# Altium schematic sheet voltage_adjustable_supply.SchDoc
size A; SheetNumber: 3; SheetTotal: 9
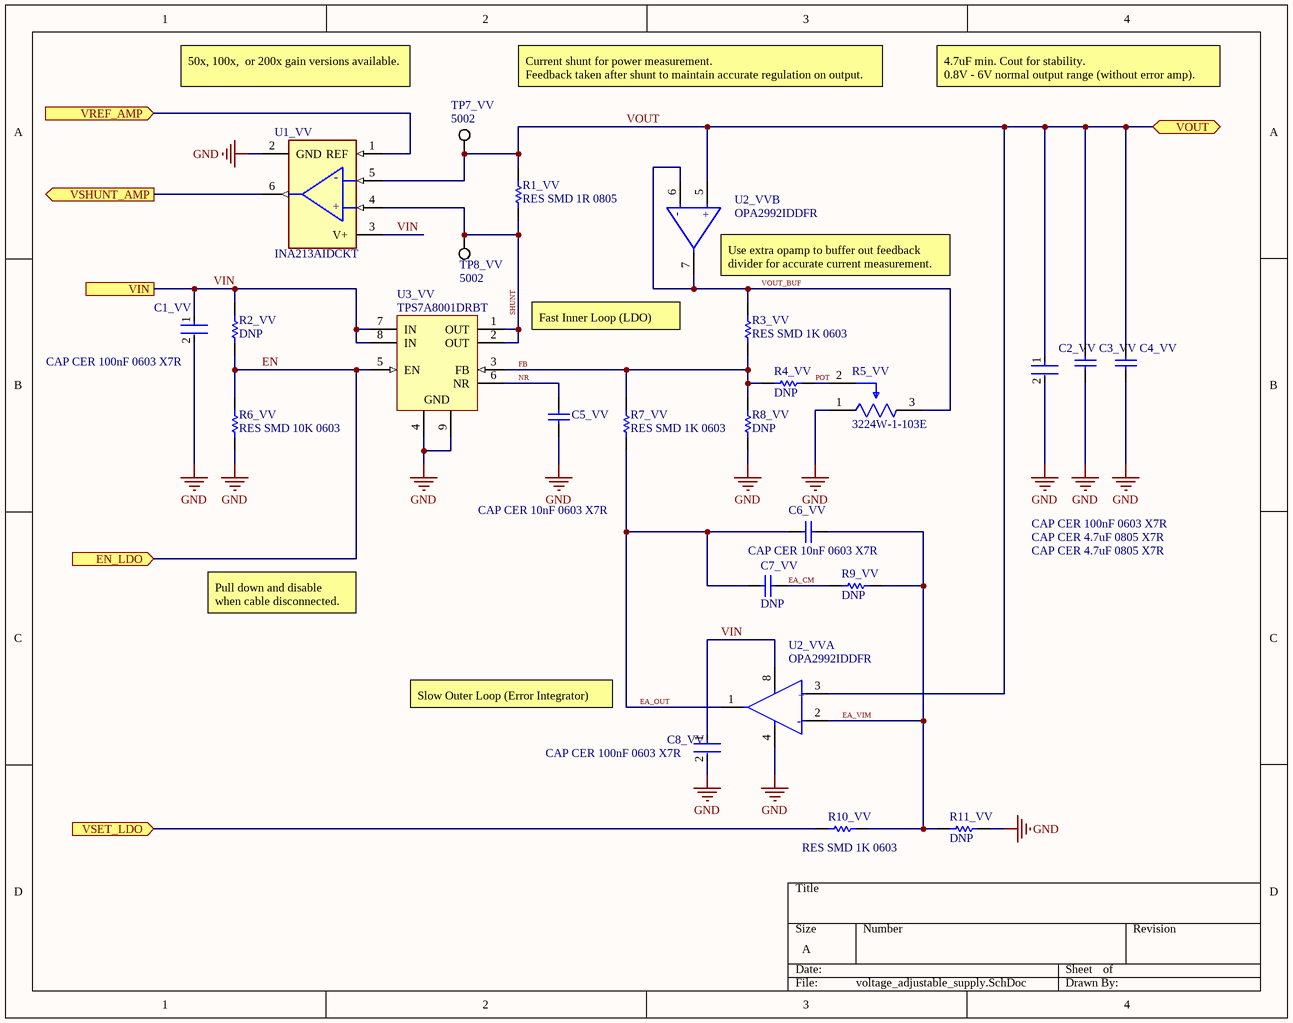
[diagram p0: voltage_adjustable_supply.SchDoc]

## Parts
C1_VV  CAP CER 100nF 0603 X7R  [FP-CC0603-DA-MFG]
C2_VV  CAP CER 100nF 0603 X7R  [FP-CC0603-DA-MFG]
C3_VV  CAP CER 4.7uF 0805 X7R  [CAPC2013X140X50NL20T25]
C4_VV  CAP CER 4.7uF 0805 X7R  [CAPC2013X140X50NL20T25]
C5_VV  CAP CER 10nF 0603 X7R  [CAPC1608X90X40ML10T20]
C6_VV  CAP CER 10nF 0603 X7R  [CAPC1608X90X40ML10T20]
C7_VV  DNP  [CAPC1608X90X40ML10T20]
C8_VV  CAP CER 100nF 0603 X7R  [FP-CC0603-DA-MFG]
R1_VV  RES SMD 1R 0805  [RESC2013X50X30NL20T20]
R2_VV  DNP  [RESC1609X50X30LL10T20]
R3_VV  RES SMD 1K 0603  [RESC1609X50X30LL10T20]
R4_VV  DNP  [RESC1609X50X30LL10T20]
R5_VV  3224W-1-103E  [FP-3224W-MFG]
R6_VV  RES SMD 10K 0603  [RESC1609X50X30LL10T20]
R7_VV  RES SMD 1K 0603  [RESC1609X50X30LL10T20]
R8_VV  DNP  [RESC1609X50X30LL10T20]
R9_VV  DNP  [RESC1609X50X30LL10T20]
R10_VV  RES SMD 1K 0603  [RESC1609X50X30LL10T20]
R11_VV  DNP  [RESC1609X50X30LL10T20]
TP7_VV  5002  [KSTN-5002]
TP8_VV  5002  [KSTN-5002]
U1_VV  INA213AIDCKT  [FP-DCK0006A-MFG]
U2_VV  OPA2992IDDFR  [FP-DDF0008A-MFG]  (parts A,B of 2)
U3_VV  TPS7A8001DRBT  [DRB0008A_V]

## Ports
EN_LDO (in), VIN, VOUT (bidir), VREF_AMP (in), VSET_LDO (in), VSHUNT_AMP (out)

## Nets
GND: C1_VV.2 C2_VV.2 C3_VV.2 C4_VV.2 C5_VV.2 C8_VV.2 R5_VV.1(CCW) R6_VV.1 R8_VV.1 R11_VV.1 U1_VV.2(GND) U2_VV.4(V-) U3_VV.4(GND) U3_VV.9(GND)
EA_CM: C7_VV.2 R9_VV.2
EA_OUT: C6_VV.1 C7_VV.1 R7_VV.1 U2_VV.1(OUT1)
EA_VIM: C6_VV.2 R9_VV.1 R10_VV.1 R11_VV.2 U2_VV.2(IN1-)
EN: R2_VV.1 R6_VV.2 U3_VV.5(EN) ; port EN_LDO
FB: R3_VV.1 R4_VV.2 R7_VV.2 R8_VV.2 U3_VV.3(FB)
NR: C5_VV.1 U3_VV.6(NR)
POT: R4_VV.1 R5_VV.2(WIPER)
SHUNT: R1_VV.1 TP8_VV.1 U1_VV.4(IN+) U3_VV.1(OUT) U3_VV.2(OUT)
VIN: C1_VV.1 C8_VV.1 R2_VV.2 U1_VV.3(V+) U2_VV.8(V+) U3_VV.7(IN) U3_VV.8(IN) ; port VIN
VOUT: C2_VV.1 C3_VV.1 C4_VV.1 R1_VV.2 TP7_VV.1 U1_VV.5(IN-) U2_VV.3(IN1+) U2_VV.5(IN2+) ; port VOUT
VOUT_BUF: R3_VV.2 R5_VV.3(CW) U2_VV.6(IN2-) U2_VV.7(OUT2)
VREF_AMP: U1_VV.1(REF) ; port VREF_AMP
VSET_LDO: R10_VV.2 ; port VSET_LDO
VSHUNT_AMP: U1_VV.6(OUT) ; port VSHUNT_AMP

## Notes on the sheet
- 50x, 100x,  or 200x gain versions available.
- Current shunt for power measurement.
  Feedback taken after shunt to maintain accurate regulation on output.
- 4.7uF min. Cout for stability.
  0.8V - 6V normal output range (without error amp).
- (near U2_VV) Use extra opamp to buffer out feedback divider for accurate current measurement.
- Fast Inner Loop (LDO)
- Pull down and disable when cable disconnected.
- Slow Outer Loop (Error Integrator)
- (in symbol CMP-04895-000035-1) -; +
- (in symbol CMP-04895-000462-1, part A) +; -
- (in symbol CMP-04895-000462-1, part B) +; -

## Library data of the parts
C1_VV C2_VV C8_VV = CMP-03422-000030-1: CAP CER 0.1UF 16V X7R 0603; Manufacturer Part Number: CC0603KRX7R7BB104; Manufacturer: YAGEO; Tolerance: 0.1; Temperature Coefficient: 15%; Material: Ceramic; Voltage Rating: 16 V; Package: CC0603-DA; ComponentLink2Description: Datasheet; Octopart: https://octopart.com/cc0603krx7r7bb104-yageo-192941; Temperature Range High: +125°C; Digikey Description: CAP CER 0.1UF 16V X7R 0603; Value: 100 nF; Voltage: 16 V; Device Class L2: Capacitors; Height: 0.9mm; Temperature: -55°C to +125°C; Device Class L1: Passive Components; Device Class L3: Ceramic Capacitors; ComponentLink2URL: http://www.yageo.com/documents/recent/UPY-GPHC_X7R_6.3V-to-50V_18.pdf; Footprint Url: http://www.yageo.com/exep/pages/download/literatures/UPY-C_GEN_24.pdf; RoHS: TRUE; Temperature Range Low: -55°C; Temperature Characteristic: X7R; Lead Free: Yes; Capacitance: 100 nF; Category: Cap; Mouser Description: Multilayer Ceramic Capacitor, CC Series, 0.1 - F, - 10%, X7R, 16 V, 0603 [1608 Metric]; Automotive: No
C3_VV C4_VV = CMP-2007-04677-1: Part Number: 0805ZC475KAT2A; Manufacturer: AVX Interconnect / Elco
C5_VV C6_VV = CMP-2100-03600-1: Chip Capacitor, 10 nF, +/- 10%, 50 V, -55 to 125 degC, 0603 (1608 Metric), RoHS, Tape and Reel; Manufacturer: Yageo; Insulation Resistance: 100GR; Voltage Rating (DC): 50V; Material: Ceramic; Lead Free: LeadFree; Case/Package: 0603; Datasheet Version: Rev. 15, 10/2016; Composition: Ceramic; Radiation Hardening: No; Thickness: 0.035inch; RoHSCompliant: True; Dielectric: X7R; Termination: SMD/SMT; Capacitance: 10nF; Manufacturer URL: http://www.yageo.com/; Tolerance: 10%; REACH SVHC: NoSVHC; Voltage: 50V; Max Operating Temperature: 125degC; Case Code (Metric): 1608; Package Quantity: 1; Case Code (Imperial): 0603; Packaging: TapeandReel; Package Reference: 0603; Width: 0.031inch; Datasheet URL: http://www.yageo.com/documents/recent/UPY-GPHC_X7R_6.3V-to-50V_15.pdf; Length: 1.6mm; Min Operating Temperature: -55degC; Number of Pins: 2; Depth: 0.8mm; Mount: SurfaceMount; Height: 0.8mm; Voltage Rating: 50V; Package Description: 2-Pin Surface Mount Device, Body 1.6 x 0.8 mm
C7_VV = CMP-2100-03600-1: Chip Capacitor, 10 nF, +/- 10%, 50 V, -55 to 125 degC, 0603 (1608 Metric), RoHS, Tape and Reel; Manufacturer: Yageo; Insulation Resistance: 100GR; Dielectric: X7R; Voltage Rating (DC): 50V; Capacitance: 10nF; Material: Ceramic; Lead Free: LeadFree; Case/Package: 0603; Datasheet Version: Rev. 15, 10/2016; Composition: Ceramic; Radiation Hardening: No; Thickness: 0.035inch; RoHSCompliant: True; Termination: SMD/SMT; Manufacturer URL: http://www.yageo.com/; Tolerance: 10%; REACH SVHC: NoSVHC; Voltage: 50V; Max Operating Temperature: 125degC; Case Code (Metric): 1608; Package Quantity: 1; Case Code (Imperial): 0603; Packaging: TapeandReel; Package Reference: 0603; Width: 0.031inch; Datasheet URL: http://www.yageo.com/documents/recent/UPY-GPHC_X7R_6.3V-to-50V_15.pdf; Length: 1.6mm; Min Operating Temperature: -55degC; Number of Pins: 2; Depth: 0.8mm; Mount: SurfaceMount; Height: 0.8mm; Voltage Rating: 50V; Package Description: 2-Pin Surface Mount Device, Body 1.6 x 0.8 mm
R1_VV = CMP-2001-04897-1: Manufacturer: Vishay Dale; Part Number: CRCW08050000Z0EB
R2_VV R4_VV R8_VV R9_VV R11_VV = CMP-2000-03820-1: Part Number: CRCW0603100KFKEA; Manufacturer: Vishay Dale
R3_VV R6_VV R7_VV R10_VV = CMP-2000-03820-1: DNP; Part Number: CRCW0603100KFKEA; Manufacturer: Vishay Dale
R5_VV = CMP-07234-000002-1: TRIMMER 10K OHM 0.25W J LEAD TOP; Manufacturer: Bourns; Tolerance: 10%; Resistance: 10kΩ; Temperature Coefficient: 100ppm/°C; Value: 10kΩ; Standoff Height: 0.2mm; Voltage Rating: 300V; Power Rating: 250mW; Device Class L3: Variable Resistors and Potentiometers; Composition: Cermet; Temperature Range Low: -65°C; Package: 3224W; ComponentLink2Description: Datasheet; Digikey Description: TRIMMER 10K OHM 0.25W J LEAD TOP; Category: Res; Mouser Description: Trimmer Resistors - SMD 4mm 10Kohms 10% Square Cermet Sealed; Temperature: -65°C to +150°C; Device Class L2: Resistors; Device Class L1: Passive Components; RoHS: TRUE; Temperature Range High: +150°C; Manufacturer Part Number: 3224W-1-103E; ComponentLink2URL: https://upverter.com/datasheet/a166fca85da25564670351d2dc712345c058bc40.pdf; Series: 3224; Height: 5.55mm; Lead Free: Yes; Octopart: https://octopart.com/3224w-1-103e-bourns-14818; Automotive: No
TP7_VV TP8_VV = CMP-2000-05182-1: Test Point, White, 1-Pin THD, RoHS, Bulk; Manufacturer: KeystoneElectronics; Outside Diameter: 2.54mm; Plating: Silver; Mounting Hole Size: 1mm; Product: TestPoints; Packaging: Bulk; Manufacturer URL: http://www.keyelco.com/; Length: 7.62mm; Datasheet Version: Rev. G, 12/2008; Type: Miniature; Product Category: CircuitBoardHardware-PCB; Material: Nylon; RoHS: True; Contact Material: PhosphorBronze; Datasheet URL: https://ciiva.com/datasheet-click-2917627?src=ciiva&sig=bd195616; Color: White; Brand: KeystoneElectronics
U1_VV = CMP-04895-000035-1: IC CURR SENSE 1 CIRCUIT SC70-6; Manufacturer: Texas Instruments; Standoff Height: 0mm; Input Bias Current: 35uA; Max Junction Temp: +150°C; Number Of Channels: 1; Max Supply Voltage: 26V; Min Supply Voltage: 2.7V; Nominal Supply Current: 100uA; Gain Bandwidth: 80kHz; Height: 0.8mm; Device Class L3: Amplifiers - Op Amps; Category: IC; Device Class L1: Integrated Circuits (ICs); Digikey Description: IC CURR SENSE 1 CIRCUIT SC70-6; Temperature Range High: +125°C; Device Class L2: Linear ICs; Package: DCK0006A; Mouser Description: SP Amp Current Shunt Monitor Single 26V 6-Pin SC-70 T/R; RoHS: TRUE; Automotive: No; Octopart: https://octopart.com/ina213aidckt-texas+instruments-7767892; Lead Free: Yes; Manufacturer Part Number: INA213AIDCKT; Temperature Range Low: -40°C; Ambient Temperature Range High: +125°C; ComponentLink2URL: http://www.ti.com/lit/ds/symlink/ina211.pdf; Ambient Temperature Range Low: -40°C; Temperature: -40°C to +125°C; ComponentLink2Description: Datasheet
U2_VV = CMP-04895-000462-1: IC OPAMP GP 2 CIRCUIT TSOT23-8
U3_VV = CMP-0395-00597-2: Single Output LDO, 1 A, Adjustable 0.8 to 6 V Output, 2.2 to 6.5 V Input, with High-Bandwidth PSRR, 8-pin SON (DRB), -40 to 125 degC, Green (RoHS & no Sb/Br); Manufacturer: Texas Instruments; Vin(Min)(V): 2.2; Iq(Typ)(mA): 0.04; Vout Adj(Max)(V): 6; SubFamily: Single Channel LDO; Accuracy(%): 3; Vin(Max)(V): 6.5; Vdo(Typ)(mV): 170; Vout Adj(Min)(V): 0.8; Iout(Max)(A): 1; PackageReference: DRB0008A; ComponentLink3URL: http://www.ti.com/litv/pdf/mpds118h; Eco-Plan: Green (RoHS & no Sb/Br); ComponentLink2Description: Datasheet; PackageVersion: 4203482-2/K; PackageDescription: 8-Pin Plastic Small Outline, Body 3 x 3 mm, Pitch 0.65 mm; ComponentLink2URL: http://www.ti.com/general/docs/lit/getliterature.tsp?genericPartNumber=TPS7A8001&fileType=pdf; ComponentLink1Description: Manufacturer URL; DatasheetVersion: SBVS135G; ComponentLink1URL: http://www.ti.com/; Mounting Technology: Surface Mount; PartNumber: TPS7A8001DRBT; ComponentLink3Description: Package Specification